# EAGLE design magnetic-linear-encoder (EAGLE 5.07)
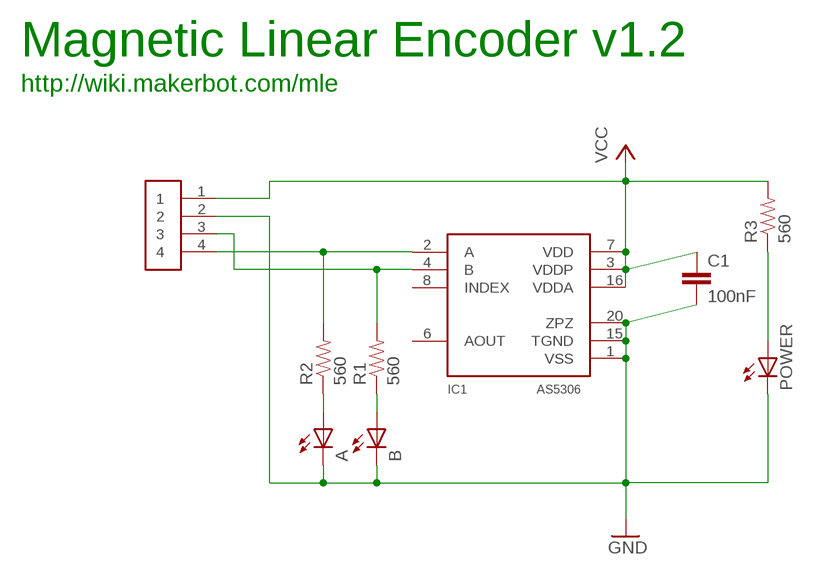
[diagram p0: schematic, sheet 1]

## Parts
A  LED0805  [LED-0805]
B  LED0805  [LED-0805]
C1  100nF  CAP0805  [0805]
IC1  AS5306  [SSOP20]
POWER  LED0805  [LED-0805]
R1  560  RESISTOR  [0805]
R2  560  RESISTOR  [0805]
R3  560  RESISTOR  [0805]
U$2  CDROM  [70553-04]

## Nets
A: IC1.2(A) R2.2 U$2.4
B: IC1.4(B) R1.2 U$2.3
GND: A.C B.C C1.2 IC1.1(VSS) IC1.15(TGND) IC1.20(ZPZ) POWER.C U$2.2
N$1: A.A R2.1
N$2: B.A R1.1
N$3: POWER.A R3.1
VCC: C1.1 IC1.3(VDDP) IC1.7(VDD) IC1.16(VDDA) R3.2 U$2.1
Unconnected: IC1.6(AOUT) IC1.8(INDEX)

## Notes on the sheet
- Magnetic Linear Encoder v1.2
- http://wiki.makerbot.com/mle

## Library data of the parts
A B POWER = SparkFun:LED: LEDs Standard schematic elements and footprints for 5mm, 3mm, 1206, and 0603 sized LEDs. 5mm - Spark Fun Electronics SKU : COM-00529 (and others)
C1 = SparkFun:CAP: Capacitor Standard 0603 ceramic capacitor, and 0.1" leaded capacitor.
IC1 = reprap:AS5306
R1-R3 = SparkFun:RESISTOR: Resistor Basic schematic elements and footprints for 0603, 1206, and PTH 1/10th watt (small) resistors.
U$2 = reprap:CDROM

## Board
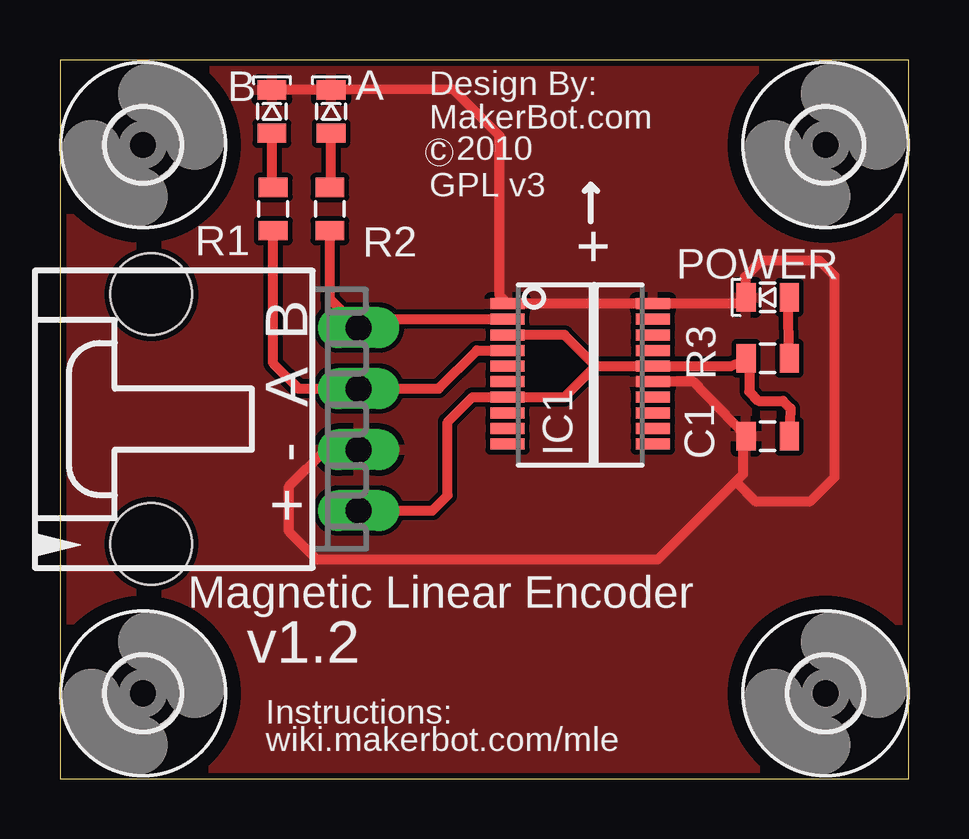
[diagram p1: board, top side]
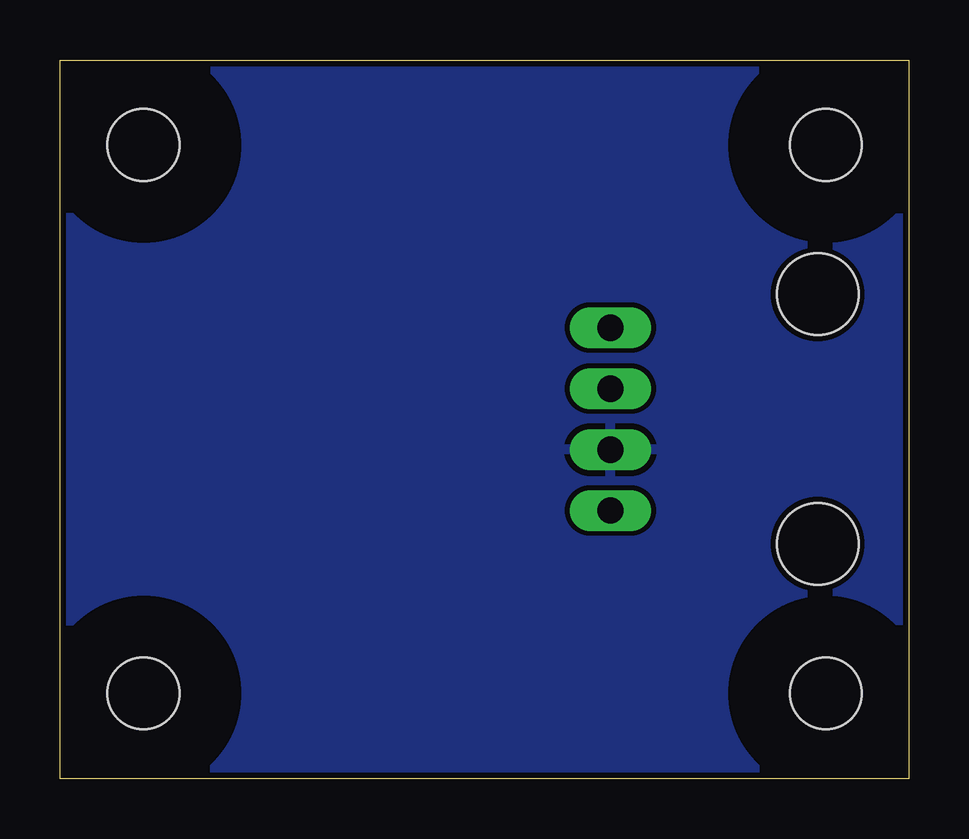
[diagram p2: board, bottom side, seen from below]

Size 35.39 x 29.96 mm. Coordinates in mm from the lower left corner, seen from the top.
Outline: 0,0 35.39,0 35.39,29.96 0,29.96 0,0
Copper layers (1*16): Top 0.035mm / dielectric 1.5mm / Bottom 0.035mm
Design rules "SparkFun": minimum track width 8mil, minimum drill 20mil, track to track 8mil, track to pad 8mil, pad to pad 8mil, via to via 8mil, smd to smd 8mil, copper to edge 10mil, drill to drill 8mil, minimum pad ring 12mil, minimum via ring 10mil, stop-mask expansion 4mil, vias tented up to drill 25mil, thermal gap 10mil

### Footprints (pad centres in the part's own frame; a part is rotated, then mirrored left to right if it is on the bottom)
LED-0805 = smd 1.2 x 0.8: A 0,-0.9; C 0,0.9
0805 = smd 0.8 x 1.2: 1 -0.9,0; 2 0.9,0
SSOP20 = smd 0.46 x 1.43: 1 -2.925,-2.59; 2 -2.275,-2.59; 3 -1.625,-2.59; 4 -0.975,-2.59; 5 -0.325,-2.59; 6 0.325,-2.59; 7 0.975,-2.59; 8 1.625,-2.59; 9 2.275,-2.59; 10 2.925,-2.59; 11 2.925,3.47; 12 2.275,3.47; 13 1.625,3.47; 14 0.975,3.47; 15 0.325,3.47; 16 -0.325,3.47; 17 -0.975,3.47; 18 -1.625,3.47; 19 -2.275,3.47; 20 -2.925,3.47
3,0 = hole 3: 0,0
70553-04 = drill 1.092 long: 1 -3.81,-7.62; 2 -1.27,-7.62; 3 1.27,-7.62; 4 3.81,-7.62 | hole 3.4: 5.207,1.016; -5.207,1.016

### Placement (x,y rotation side)
A  11.3,27.81 0 top
B  8.84,27.81 0 top
C1  29.5,14.28 180 top
IC1  21.25,16.88 270 top
POWER  29.5,20.07 90 top
R1  8.89,23.75 270 top
R2  11.25,23.75 270 top
R3  29.5,17.53 180 top
U$1  [3,0]  3.47,3.56 0 top
U$2  4.83,14.99 90 top
U$3  [3,0]  31.91,3.56 0 top
U$4  [3,0]  3.47,26.42 0 top
U$5  [3,0]  31.91,26.42 0 top

### Tracks (layer width: path | path; a pad name or v marks a point on that pad's centre or on a via)
A
  Top 0.406: R2.2 11.25,19.99 U$2.4 12.8,19.15 IC1.2
B
  Top 0.406: R1.2 8.89,17.31 9.94,16.26 U$2.3 15.79,16.26 17.38,17.85 IC1.4
GND
  Top 0.406: IC1.15 26.4,16.55 C1.2 28.49,14.21 28.49,12.7 28.17,12.38 | B.C A.C 16.39,28.74 18.32,26.8 18.32,20.13 IC1.1 IC1.20 28.57,19.8 | U$2.2 11.09,13.72 9.56,12.19 9.56,10.29 10.71,9.14 24.93,9.14 28.17,12.38 | 28.57,19.8 28.57,20.91 29.25,21.59 31.66,21.59 32.3,20.96 32.3,12.57 31.28,11.56 28.99,11.56 28.17,12.38 | 28.57,19.8 POWER.C
  pour Bottom: -1.61,31.5 35.22,31.5 35.22,-0.25 -1.61,-0.25
  pour Top: -1.61,31.5 35.22,31.5 35.22,-0.25 -1.61,-0.25
N$1
  Top 0.406: A.A 11.3,24.65 R2.1
N$2
  Top 0.406: B.A 8.84,24.65 R1.1
N$3
  Top 0.406: R3.1 30.35,19.87 POWER.A
VCC
  Top 0.406: C1.1 30.45,15.43 30.14,15.75 29.12,15.75 28.74,16.13 28.74,17.44 R3.2 28.59,17.45 27.95,17.2 IC1.16 22.33,17.2 | U$2.1 15.53,11.18 16.17,11.81 16.17,14.86 17.21,15.9 IC1.7 21.03,15.9 22.33,17.2 | IC1.3 21.03,18.5 22.33,17.2

### Text on the board
tPlace: Design By: | MakerBot.com | c 2010 | GPL v3 | + | B | A | - | + | Magnetic Linear Encoder | v1.2 | Instructions: | wiki.makerbot.com/mle